# EAGLE design board (EAGLE 7.6.0)

## Sheet 1 of 2
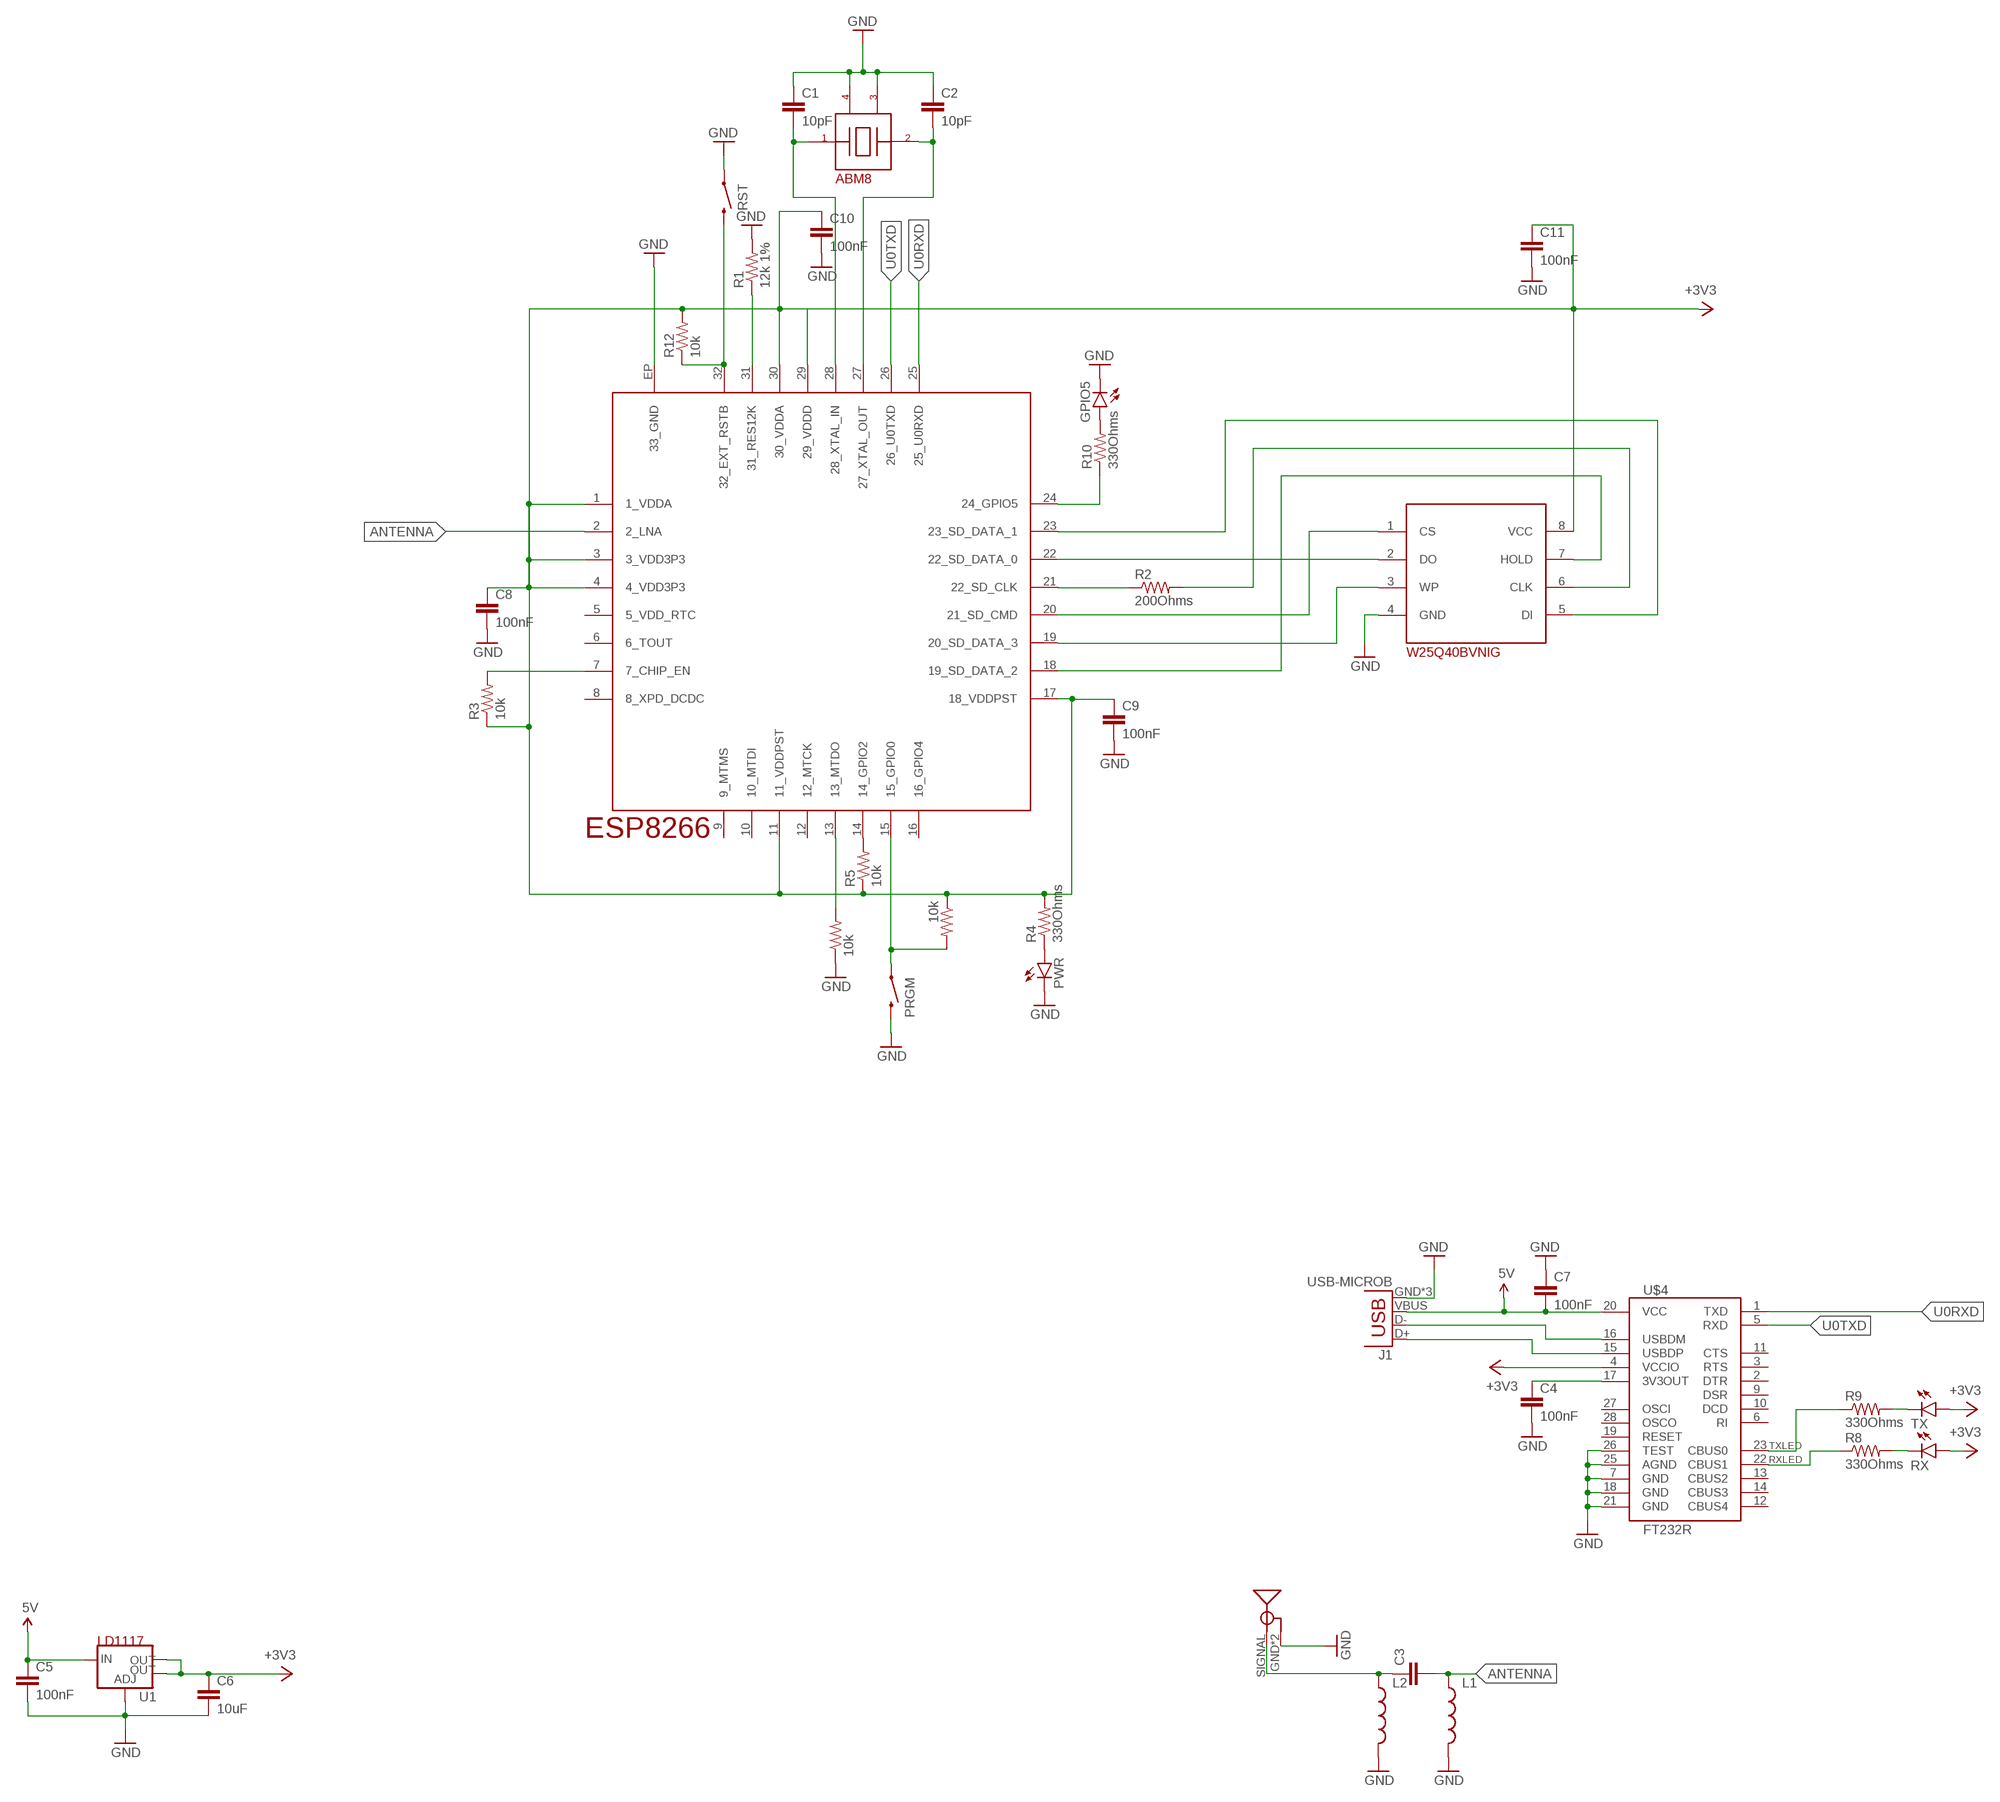
[diagram p0: schematic, sheet 1]

### Parts
C1  10pF  CAP0603-CAP  [0603-CAP]
C2  10pF  CAP0603-CAP  [0603-CAP]
C3  CAP0402-CAP  [0402-CAP]
C4  100nF  CAP0603-CAP  [0603-CAP]
C5  100nF  CAP0603-CAP  [0603-CAP]
C6  10uF  CAP0603-CAP  [0603-CAP]
C7  100nF  CAP0603-CAP  [0603-CAP]
C8  100nF  CAP0603-CAP  [0603-CAP]
C9  100nF  CAP0603-CAP  [0603-CAP]
C10  100nF  CAP0603-CAP  [0603-CAP]
C11  100nF  CAP0603-CAP  [0603-CAP]
GPIO5  LED0603  [LED-0603]
J1  USB-MICROB  [USB-MICROB]
L1  INDUCTOR0402  [C0402]
L2  INDUCTOR0402  [C0402]
PRGM  SWITCH-MOMENTARY-2PTH  [TACTILE-PTH]
PWR  LED0603  [LED-0603]
R1  12k 1%  12KOHM-1/10W-1%(0603)  [0603-RES]
R2  200Ohms  RESISTOR0402  [0402-RES]
R3  10k  RESISTOR0603-RES  [0603-RES]
R4  330Ohms  RESISTOR0603-RES  [0603-RES]
R5  10k  RESISTOR0603-RES  [0603-RES]
R6  10k  RESISTOR0603-RES  [0603-RES]
R7  10k  RESISTOR0603-RES  [0603-RES]
R8  330Ohms  RESISTOR0603-RES  [0603-RES]
R9  330Ohms  RESISTOR0603-RES  [0603-RES]
R10  330Ohms  RESISTOR0603-RES  [0603-RES]
R12  10k  RESISTOR0603-RES  [0603-RES]
RST  SWITCH-MOMENTARY-2PTH  [TACTILE-PTH]
RX  LED0603  [LED-0603]
TX  LED0603  [LED-0603]
U1  V_REG_LM1117SOT223  [SOT223]
U$1  W25Q40BVNIG  [SOIC-8]
U$2  ESP8266  [QFN-32]
U$3  ABM8  [ABM8]
U$4  FT232R  [SSOP-28]
U$5  OMNIANTENNA  [ANTENNA]

### Nets
+3V3: C6.1 C8.1 C9.1 C10.1 C11.1 R3.1 R4.2 R5.1 R6.1 R12.2 RX.A TX.A U1.2(OUT) U1.4(OUT) U$1.8(VCC) U$2.1(1_VDDA) U$2.3(3_VDD3P3) U$2.4(4_VDD3P3) U$2.11(11_VDDPST) U$2.17(18_VDDPST) U$2.29(29_VDDD) U$2.30(30_VDDA) U$4.4(VCCIO)
ANTENNA: C3.2 L1.1 U$2.2(2_LNA)
GND: C1.1 C2.1 C4.2 C5.2 C6.2 C7.1 C8.2 C9.2 C10.2 C11.2 GPIO5.C J1.GND J1.MT1(GND) J1.MT2(GND) L1.2 L2.2 PRGM.3 PWR.C R1.2 R7.1 RST.1 U1.1(ADJ) U$1.4(GND) U$2.EP(33_GND) U$3.P$2(GND) U$3.P$4(GND2) U$4.7(GND) U$4.18(GND) U$4.21(GND) U$4.25(AGND) U$4.26(TEST) U$5.GND U$5.GND1(GND)
N$1: R2.2 U$1.6(CLK)
N$2: U$1.2(DO) U$2.22(22_SD_DATA_0)
N$3: U$1.5(DI) U$2.23(23_SD_DATA_1)
N$4: U$1.7(HOLD) U$2.18(19_SD_DATA_2)
N$5: R1.1 U$2.31(31_RES12K)
N$6: U$1.3(WP) U$2.19(20_SD_DATA_3)
N$7: U$1.1(CS) U$2.20(21_SD_CMD)
N$8: R2.1 U$2.21(22_SD_CLK)
N$12: C3.1 L2.1 U$5.SIGNAL
N$13: R3.2 U$2.7(7_CHIP_EN)
N$14: PWR.A R4.1
N$16: R5.2 U$2.14(14_GPIO2)
N$17: C4.1 U$4.17(3V3OUT)
N$21: R7.2 U$2.13(13_MTDO)
N$40: J1.D+ U$4.15(USBDP)
N$41: J1.D- U$4.16(USBDM)
N$48: R8.1 U$4.22(CBUS1)
N$49: R9.1 U$4.23(CBUS0)
N$50: R9.2 TX.C
N$51: PRGM.1 R6.2 U$2.15(15_GPIO0)
N$52: GPIO5.A R10.2
N$53: R10.1 U$2.24(24_GPIO5)
N$54: R12.1 RST.3 U$2.32(32_EXT_RSTB)
RX: R8.2 RX.C
U0RXD: U$2.25(25_U0RXD) U$4.1(TXD)
U0TXD: U$2.26(26_U0TXD) U$4.5(RXD)
VUSB: C5.1 C7.2 J1.VBUS U1.3(IN) U$4.20(VCC) ; supply symbol labelled 5V
XTAL_IN: C1.2 U$2.28(28_XTAL_IN) U$3.P$1(IN)
XTAL_OUT: C2.2 U$2.27(27_XTAL_OUT) U$3.P$3(OUT)
Unconnected: U$2.5(5_VDD_RTC) U$2.6(6_TOUT) U$2.8(8_XPD_DCDC) U$2.9(9_MTMS) U$2.10(10_MTDI) U$2.12(12_MTCK) U$2.16(16_GPIO4) U$4.2(DTR) U$4.3(RTS) U$4.6(RI) U$4.9(DSR) U$4.10(DCD) U$4.11(CTS) U$4.12(CBUS4) U$4.13(CBUS2) U$4.14(CBUS3) U$4.19(RESET) U$4.27(OSCI) U$4.28(OSCO)

## Sheet 2 of 2

## Library data of the parts
C1-C11 = SparkFun-Capacitors:CAP: Capacitor Standard 0603 ceramic capacitor, and 0.1" leaded capacitor.
GPIO5 PWR RX TX = SparkFun-LED:LED: LEDs Standard schematic elements and footprints for 5mm, 3mm, 1206, and 0603 sized LEDs. 5mm - Spark Fun Electronics SKU : COM-00529 (and others)
J1 = SparkFun-Connectors:USB: USB Connectors USB-B-PTH is fully proven SKU : PRT-00139/CONN-08278 USB-miniB is fully proven SKU : PRT-00587 USB-A-PCB is untested. USB-A-H is throughly reviewed, but untested. Spark Fun Electronics SKU : PRT-00437 USB-B-SMT is throughly reviewed, but untested. Needs silkscreen touching up. USB-A-S has not been used/tested USB-MB-H has not been used/tested USB-MICROB has been used. CONN-09505; PROD_ID: CONN-09505
L1 L2 = SparkFun-Passives:INDUCTOR: Inductors Basic Inductor/Choke - 0603 and 1206. Footprints are not proven and vary greatly between part numbers. INDUCTOR POWER 3.3UH 4.0A SMD 0.197" L x 0.197" W x 0.177" H (5.00mm x 5.00mm x 4.50mm)
PRGM RST = SparkFun-Electromechanical:SWITCH-MOMENTARY-2: Various NO switches- pushbuttons, reed, etc; PROD_ID: SWCH-08441
R1 = SparkFun-Resistors:12KOHM-1/10W-1%(0603): RES-10327; PROD_ID: RES-10327; VALUE: 12k
R2-R10 R12 = SparkFun-Resistors:RESISTOR: Resistor Basic schematic elements and footprints for 0603, 1206, and PTH resistors.
U1 = SparkFun-PowerIC:V_REG_LM1117: Voltage Regulator LM1117 Standard adjustable voltage regulator but in SMD form. Spark Fun Electronics SKU : COM-00595; PROD_ID: VREG-08170
U$1 = W25Q40BVNIG:W25Q40BVNIG
U$2 = esp8266:ESP8266
U$3 = ABM8:ABM8
U$4 = GeekAmmo:FT232R: FT232R USB UART IC The FT232R is a USB to serial UART interface with advanced features. http://www.ftdichip.com/Support/Documents/DataSheets/ICs/DS_FT232R.pdf
U$5 = antenna:OMNIANTENNA

## Board
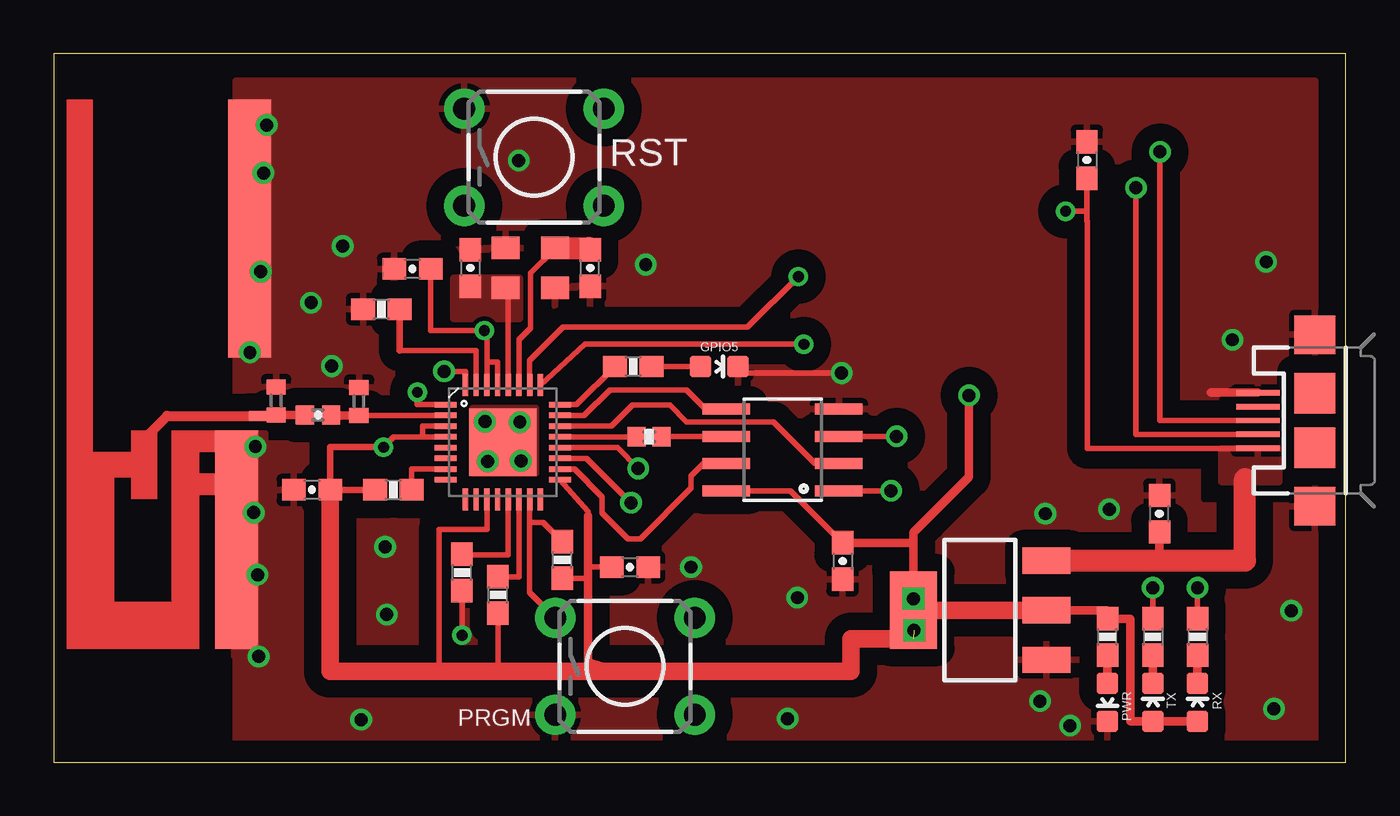
[diagram p1: board, top side]
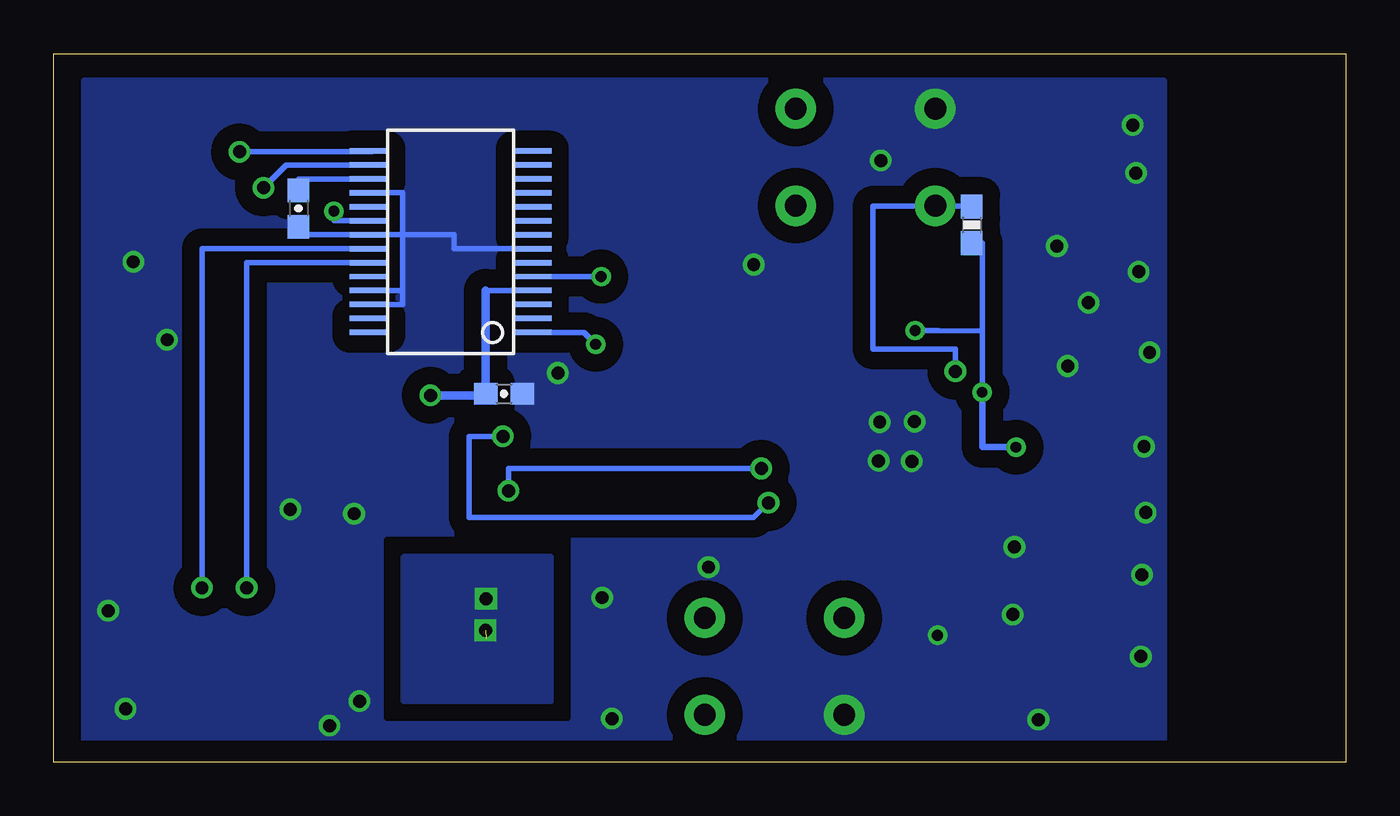
[diagram p2: board, bottom side, seen from below]

Size 60.2 x 33.02 mm. Coordinates in mm from the lower left corner, seen from the top.
Outline: 0,0 60.2,0 60.2,33.02 0,33.02 0,0
Copper layers (1*16): Top 0.035mm / dielectric 1.5mm / Bottom 0.035mm
Design rules "PCBway": minimum track width 6mil, minimum drill 0.3mm, track to track 0.205mm, track to pad 0.205mm, pad to pad 0.205mm, via to via 0.205mm, smd to smd 8mil, copper to edge 40mil, drill to drill 8mil, minimum pad ring 10mil, minimum via ring 8mil, stop-mask expansion 4mil, vias tented up to drill 25mil, thermal gap 10mil

### Footprints (pad centres in the part's own frame; a part is rotated, then mirrored left to right if it is on the bottom)
0603-CAP = smd 1.092 x 1: 1 -0.85,0; 2 0.85,0
0402-CAP = smd 0.85 x 0.9: 1 -0.61,0; 2 0.61,0
LED-0603 = smd 1 x 1: A 0,-0.877; C 0,0.877
USB-MICROB = smd 0.254 x 2.032: D+ 0,2.65; D- -0.65,2.65; GND 1.3,2.65; ID 0.65,2.65; VBUS -1.3,2.65 | smd 1.8 x 1.9: MT1 -4,0; MT2 4,0 | smd 1.9 x 1.9: P$1 -1.27,0; P$2 1.27,0
C0402 = smd 0.7 x 0.9: 1 -0.65,0; 2 0.65,0
TACTILE-PTH = drill 1.016 pad 1.88: 1 -3.251,2.261; 2 3.251,2.261; 3 -3.251,-2.261; 4 3.251,-2.261
0603-RES = smd 1.1 x 1: 1 -0.85,0; 2 0.85,0
0402-RES = smd 0.838 x 0.9: 1 -0.584,0; 2 0.584,0
SOT223 = smd 1.219 x 2.235: 1 -2.311,-3.099; 2 0,-3.099; 3 2.311,-3.099 | smd 3.6 x 2.2: 4 0,3.099
SOIC-8 = smd 2.21 x 0.508: 1 -2.616,1.905; 2 -2.616,0.635; 3 -2.616,-0.635; 4 -2.616,-1.905; 5 2.616,-1.905; 6 2.616,-0.635; 7 2.616,0.635; 8 2.616,1.905
QFN-32 = smd 0.254 x 1.016: 1 -1.75,-2.667; 2 -1.25,-2.667; 3 -0.75,-2.667; 4 -0.25,-2.667; 5 0.25,-2.667; 6 0.75,-2.667; 7 1.25,-2.667; 8 1.75,-2.667; 17 1.75,2.667; 18 1.25,2.667; 19 0.75,2.667; 20 0.25,2.667; 21 -0.25,2.667; 22 -0.75,2.667; 23 -1.25,2.667; 24 -1.75,2.667 | smd 1.016 x 0.254: 9 2.667,-1.75; 10 2.667,-1.25; 11 2.667,-0.75; 12 2.667,-0.25; 13 2.667,0.25; 14 2.667,0.75; 15 2.667,1.25; 16 2.667,1.75; 25 -2.667,1.75; 26 -2.667,1.25; 27 -2.667,0.75; 28 -2.667,0.25; 29 -2.667,-0.25; 30 -2.667,-0.75; 31 -2.667,-1.25; 32 -2.667,-1.75 | smd 3.15 x 3.15: EP 0,0
ABM8 = smd 1.3 x 1.05: P$1 -1.15,-0.925; P$2 1.15,-0.925; P$3 1.15,0.925; P$4 -1.15,0.925
SSOP-28 = smd 0.254 x 1.778: 1 -4.225,-3.81; 2 -3.575,-3.81; 3 -2.925,-3.81; 4 -2.275,-3.81; 5 -1.625,-3.81; 6 -0.975,-3.81; 7 -0.325,-3.81; 8 0.325,-3.81; 9 0.975,-3.81; 10 1.625,-3.81; 11 2.275,-3.81; 12 2.925,-3.81; 13 3.575,-3.81; 14 4.225,-3.81; 15 4.225,3.81; 16 3.575,3.81; 17 2.925,3.81; 18 2.275,3.81; 19 1.625,3.81; 20 0.975,3.81; 21 0.325,3.81; 22 -0.325,3.81; 23 -0.975,3.81; 24 -1.625,3.81; 25 -2.275,3.81; 26 -2.925,3.81; 27 -3.575,3.81; 28 -4.225,3.81
ANTENNA = smd 12 x 2: GND 19.58,-8.52 | smd 10.18 x 2: GND1 5.09,-7.91 | smd 0.46 x 1: SIGNAL 10.86,-9

### Placement (x,y rotation side)
C1  19.41,23.04 270 top
C2  24.99,23.04 90 top
C3  12.32,16.18 0 top
C4  48.79,25.81 270 bottom
C5  51.51,11.58 90 top
C6  39.22,17.17 0 bottom
C7  48.13,28.07 270 top
C8  12.04,12.7 180 top
C9  26.85,9.09 0 top
C10  16.71,22.99 180 top
C11  36.75,9.37 270 top
GPIO5  31.01,18.44 270 top
J1  58.75,15.93 90 top
L1  14.22,16.81 90 top
L2  10.36,16.84 90 top
PRGM  26.62,4.47 0 top
PWR  49.1,2.79 180 top
R1  15.27,21.11 180 top
R2  27.74,15.16 0 top
R3  15.82,12.7 0 top
R4  49.1,5.84 90 top
R5  20.7,7.8 90 top
R6  23.7,9.42 90 top
R7  19.02,8.84 90 top
R8  53.29,5.84 270 top
R9  51.21,5.84 270 top
R10  27,18.44 0 top
R12  17.42,25.04 270 bottom
RST  22.38,28.19 0 top
RX  53.29,2.79 0 top
TX  51.21,2.79 0 top
U1  43.15,7.09 90 top
U$1  33.96,14.55 180 top
U$2  20.93,14.91 270 top
U$3  22.2,23.04 0 top
U$4  41.71,24.26 90 bottom
U$5  0.61,5.28 90 top

### Tracks (layer width: path | path; a pad name or v marks a point on that pad's centre or on a via)
+3V3  (via drill 0.5, 0.6)  (1 unrouted)
  Top 0.254: U$2.11 20.18,10.85 17.96,10.85 17.96,4.24 | v16.94,17.25 16.94,16.66 U$2.1 | v15.37,14.68 15.85,15.16 17.2,15.16 | C10.1 17.56,20.12 v20.07,20.12 20.18,20.12 20.18,18.64 | U$2.30 20.18,18.64 | 24.89,11.15 24.89,11.7 U$2.17 | 40.06,10.29 40.06,10.08 | C11.1 34.33,12.65 U$1.8 | C9.1 25.04,9.09 24.89,8.94 24.89,8.57 R6.1 | 12.89,4.24 12.87,4.24 | 40.62,11.29 40.62,11.27 | U$2.4 17.2,15.16 | U$2.3 17.2,15.66 17.2,15.16 | U$2.29 20.68,18.64 20.18,18.64 | R5.1 20.7,4.27 20.68,4.24 | 34.18,4.24 33.73,4.24
  Top 0.305: v15.37,14.68 12.89,14.68 C8.1 R3.1 | 12.89,4.24 13.36,4.24
  Top 0.406: 24.89,11.48 24.89,11.15 24.89,8.94 24.89,4.65 26.29,4.24 | 33.15,4.24 32.84,4.24 | 32.98,4.24 33.3,4.24 | 40.06,10.22 40.06,10.71 40.62,11.27 42.65,13.3 v42.65,17.09 | v40.06,7.62 40.06,10.08 40.06,10.22 | C11.1 40.06,10.22 | U1.2 49.1,7.09 R4.2 50.16,6.68 50.16,1.92 TX.A RX.A
  Top 0.813: 12.97,4.24 13.36,4.24 17.96,4.24 20.68,4.24 26.29,4.24 32.84,4.24 33.3,4.24 33.73,4.24 37.13,4.24 37.13,5.74 40.06,5.74 | C8.1 12.89,4.24 | v40.08,6.15 40.06,6.53 40.56,6.86 40.56,6.5 | U1.2 U1.4 | U1.4 | U1.4 v40.06,7.62
  Bottom 0.254: v16.94,17.25 16.94,20.09 | 16.94,20.09 18.97,20.11 v20.07,20.12 | U$4.4 40.07,21.98 | 40.07,17.83 C6.1 40.07,17.09 | R12.2 16.94,24.19 16.94,20.09
  Bottom 0.305: v16.94,17.25 16.94,14.68 v15.37,14.68
  Bottom 0.406: 40.07,21.98 C6.1 | v42.65,17.09 40.07,17.09
  pour Bottom: 37.06,9.58 43.87,9.58 43.87,2.87 37.06,2.87
ANTENNA
  Top 0.254: U$2.2 L1.1 | 12.93,16.16 C3.2
  Top 0.406: L1.1 12.93,16.16
GND  (via drill 0.5, 0.6)
  Top 0.254: GPIO5.C 32.2,18.14 v36.7,18.14 | R7.1 v19.02,5.92
  Top 0.406: J1.GND 53.9,17.23
  Bottom 0.254: U$4.18 43.94,26.53 43.94,24.59 | 43.94,24.59 45.36,24.59 U$4.21 48.77,24.58 48.77,25.12 | U$4.25 43.94,21.98 | 43.94,21.98 43.94,24.59 | U$4.26 43.94,21.33 43.94,21.98 | 48.34,24.58 C4.2 | 43.94,24.59 41.55,24.59 41.55,23.93 38.05,23.93 U$4.7
  other vias: 9.65,22.86 9.4,14.71 9.32,11.63 9.5,8.74 20.09,15.88 54.91,19.68 56.85,2.49 49.17,11.79 11.99,21.41 12.95,18.47 9.14,19.1 13.46,24.05 9.55,4.93 9.78,27.46 9.93,29.69 15.44,10.03 15.52,6.88 34.65,7.67 29.69,9.09 21.72,15.85 21.77,14.05 20.22,14.02 27.58,23.19 56.49,23.32 57.66,7.06 46.2,11.58 45.95,2.84 47.35,1.7 21.67,28.04 14.33,1.98 34.19,2.03
  pour Top (isolate 0.406, no thermals): 19.51,16.51 19.51,13.46 22.48,13.46 22.48,16.51
  pour Top (isolate 0.813, rank 6): 8.48,0.51 58.78,0.51 58.78,31.75 8.48,31.75
  pour Bottom (isolate 0.813, rank 6, no thermals): 8.48,31.75 58.78,31.75 58.78,0.51 8.48,0.51
  pour Top (no thermals): 8.46,18.39 8.46,31.75 10.69,31.75 10.69,18.39
  pour Top (no thermals): 8.38,15.34 8.38,4.93 9.88,4.93 9.88,15.34
N$1
  Top 0.254: R2.2 28.35,15.19 U$1.6
N$2
  Top 0.254: U$2.22 26,15.66 26.98,16.64 28.7,16.64 29.49,15.85 33.53,15.85 35.46,13.92 U$1.2
N$3
  Top 0.254: U$2.23 24.72,16.16 25.91,17.35 29.49,17.35 30.38,16.46 U$1.5
N$4
  Top 0.254: U$1.7 30.28,13.92 29.69,13.34 29.69,12.78 27.33,10.41 26.75,10.41 25.55,11.61 25.55,12.37 24.26,13.66 U$2.18
N$5
  Top 0.254: U$2.31 19.68,19.18 16.11,19.18
  Top 0.305: 16.11,19.18 R1.1
N$6  (via drill 0.6)
  Top 0.254: v39.27,15.19 U$1.3 | U$2.19 24.83,14.16 v26.9,12.09
  Bottom 0.254: v39.27,15.19 40.84,15.19 40.84,11.4 27.58,11.4 v26.9,12.09
N$7  (via drill 0.6)
  Top 0.254: v39.01,12.65 U$1.1 | U$2.20 26.26,14.66 v27.23,13.69
  Bottom 0.254: v27.23,13.69 39.01,13.69 v39.01,12.65
N$8
  Top 0.254: U$2.21 23.43,15.16 R2.1
N$12
  Top 0.254: C3.1 | U$5.SIGNAL 10.32,16.14 L2.1 10.37,16.18
  Top 0.406: 10.37,16.18 C3.1
N$13
  Top 0.254: R3.2 16.67,13.66 U$2.7
N$14
  Top 0.406: PWR.A R4.1
N$16
  Top 0.254: R5.2 21.68,8.65 U$2.14
N$17
  Bottom 0.254: U$4.17 48.79,27.18 C4.1
N$21
  Top 0.254: R7.2 19.02,9.65 21.18,9.65 U$2.13
N$40  (via drill 0.6)
  Top 0.254: J1.D+ 51.54,15.93 v51.54,28.45
  Bottom 0.254: v51.54,28.45 45.36,28.45 U$4.15
N$41  (via drill 0.6)
  Top 0.254: J1.D- 50.42,15.28 v50.42,26.77
  Bottom 0.254: v50.42,26.77 49.36,27.83 U$4.16
N$48  (via drill 0.6)
  Top 0.254: v53.29,8.13 R8.1
  Bottom 0.254: U$4.22 53.29,23.93 v53.29,8.13
N$49  (via drill 0.6)
  Top 0.254: v51.21,8.13 R9.1
  Bottom 0.254: U$4.23 51.21,23.28 v51.21,8.13
N$50
  Top 0.406: R9.2 TX.C
N$51
  Top 0.254: PRGM.1 22.18,7.92 22.18,11.18 | 22.18,11.18 U$2.15 | R6.2 22.8,11.18 22.18,11.18
N$52
  Top 0.254: R10.2 GPIO5.A
N$53
  Top 0.254: U$2.24 24.37,16.66 R10.1
N$54  (via drill 0.6)
  Top 0.254: v18.19,18.21 19.18,18.21 U$2.32
  Bottom 0.254: v18.19,18.21 18.19,19.25 22.02,19.25 22.02,25.91 19.15,25.91 | 17.42,25.93 R12.1 17.42,25.91 19.15,25.91 | RST.3 19.15,25.93 19.15,25.91
RX
  Top 0.406: R8.2 RX.C
U0RXD  (via drill 0.5)
  Top 0.254: U$2.25 24.75,19.48 v34.95,19.48
  Bottom 0.254: v34.95,19.48 35.5,20.03 U$4.1
U0TXD  (via drill 0.5)
  Top 0.254: U$2.26 22.18,18.73 23.72,20.27 32.33,20.27 v34.7,22.63
  Bottom 0.254: v34.7,22.63 38.05,22.63 U$4.5
VUSB  (via drill 0.5)
  Top 0.254: J1.VBUS 48.16,14.63 48.16,25.22 48.13,25.22 48.13,25.68 | 48.13,25.68 C7.2 | v47.14,25.68 48.13,25.68
  Top 0.406: 51.51,9.4 C5.1
  Top 1.016: U1.3 51.51,9.4 55.5,9.4 55.5,13.18
  Bottom 0.254: U$4.20 47.14,25.23 v47.14,25.68
  pour Top (isolate 0.305): 57.1,14.63 54.41,14.63 54.41,13.06 57.1,13.06
XTAL_IN
  Top 0.254: U$2.28 21.18,22.11 U$3.P$1
  pour Top (no thermals): 18.64,22.53 21.69,22.53 21.69,20.7 18.64,20.7
XTAL_OUT
  Top 0.254: U$2.27 21.68,19.7 22.23,20.24 22.23,22.79 23.35,23.91 U$3.P$3
  Top 0.813: 24.92,23.96 C2.2
  Top 1.016: U$3.P$3 24.92,23.96